# EAGLE design EMG FSR (EAGLE 9.6.2)
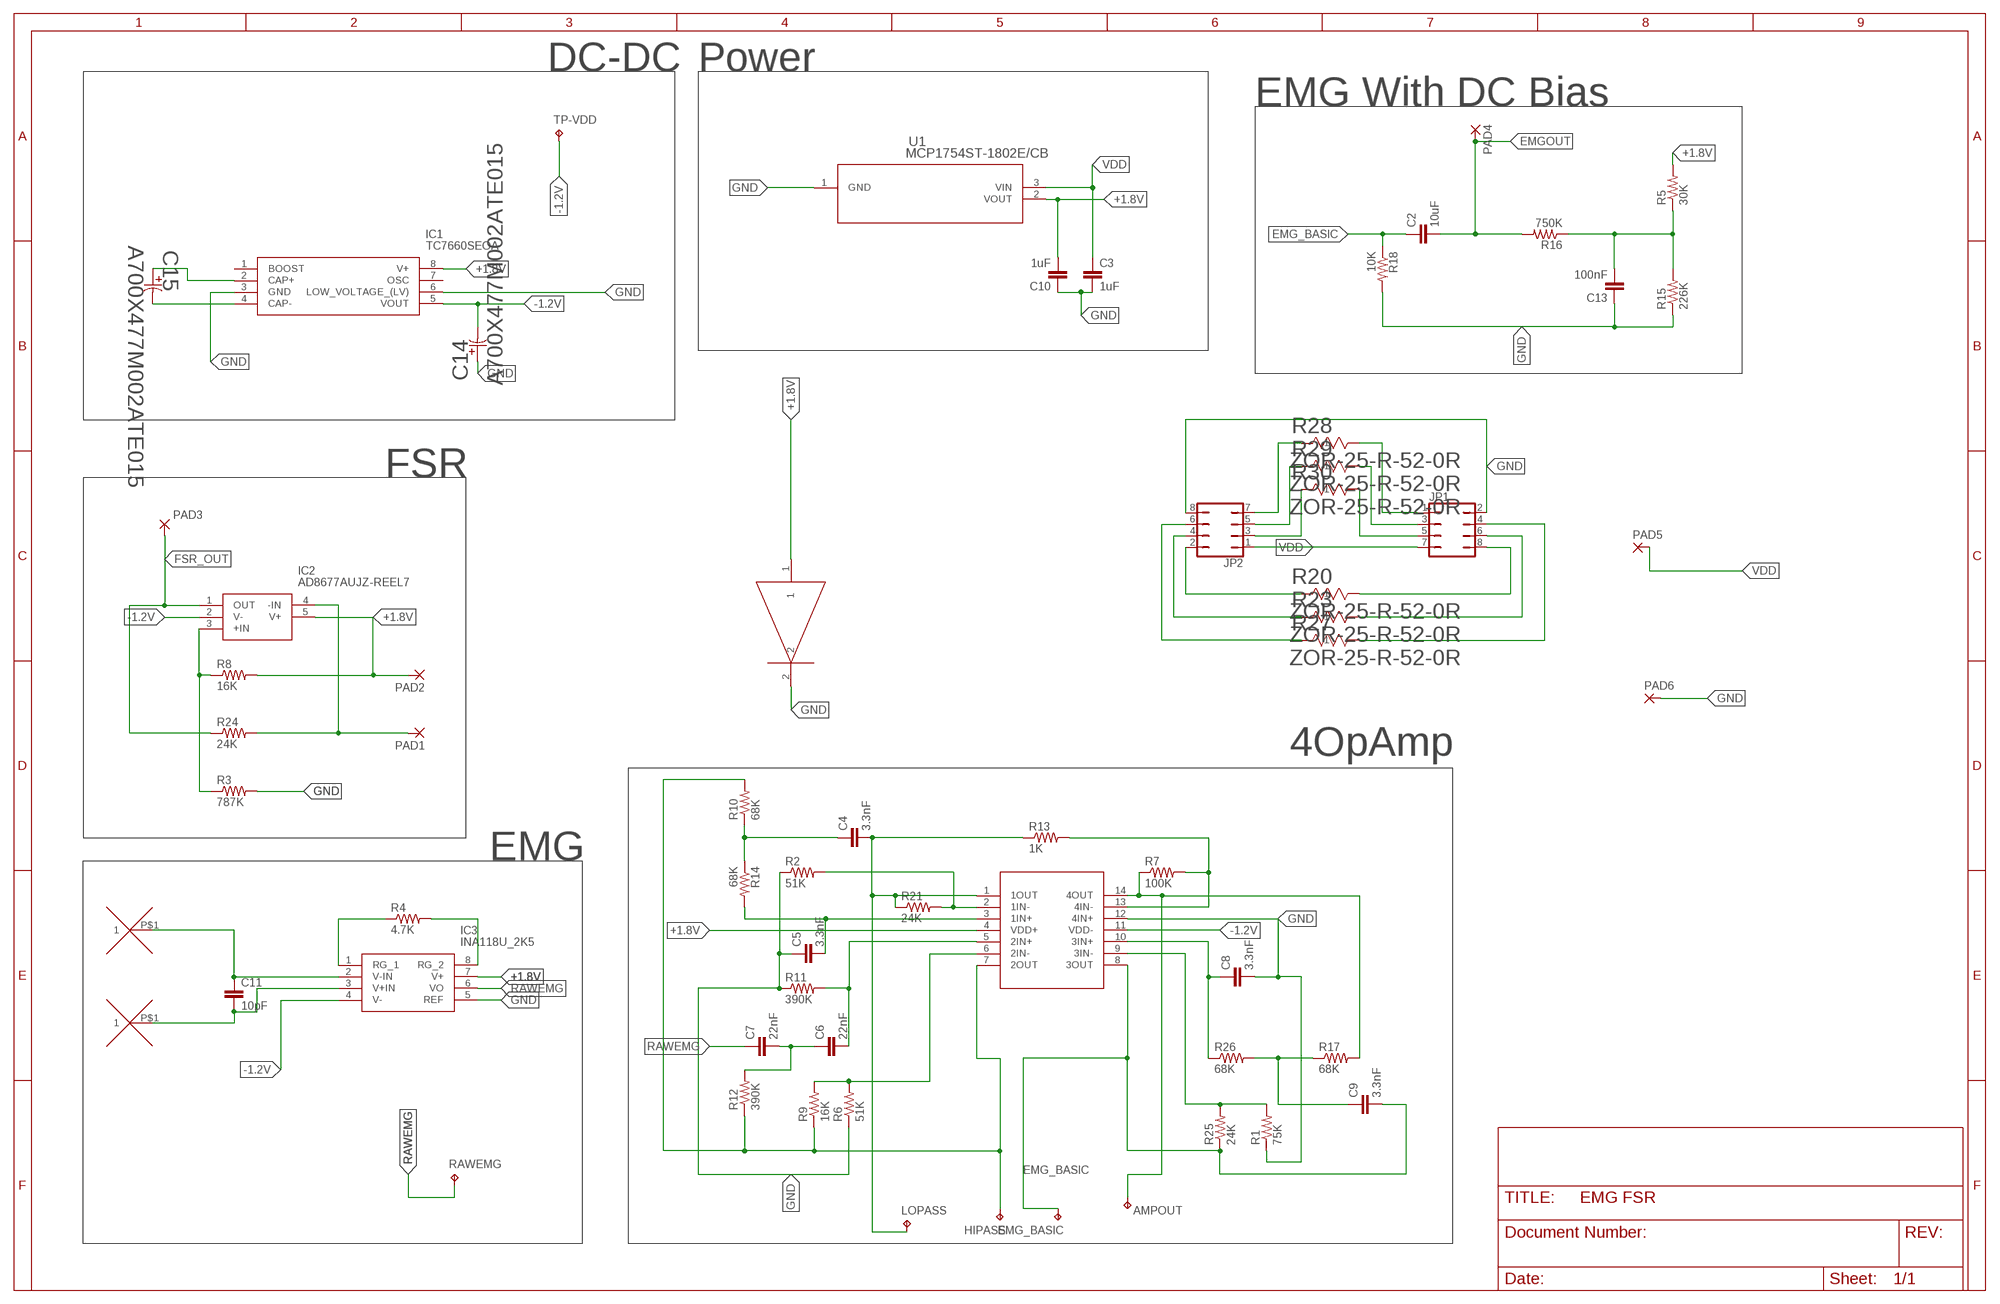
[diagram p0: schematic, sheet 1]

## Parts
AMPOUT  TPTP08R  [TP08R]
C2  10uF  C-EUC0402  [C0402]
C3  1uF  C-EUC0402  [C0402]
C4  3.3nF  C-EUC1206  [C1206]
C5  3.3nF  C-EUC1206  [C1206]
C6  22nF  C-EUC0805  [C0805]
C7  22nF  C-EUC0805  [C0805]
C8  3.3nF  C-EUC1206  [C1206]
C9  3.3nF  C-EUC1206  [C1206]
C10  1uF  C-EUC0402  [C0402]
C11  10pF  C-EUC0402  [C0402]
C13  100nF  C-EUC0402  [C0402]
C14  A700X477M002ATE015  [PCAP7343-43_KEMET_KEM]
C15  A700X477M002ATE015  [PCAP7343-43_KEMET_KEM]
EMG_BASIC  TPTP08R  [TP08R]
HIPASS  TPTP08R  [TP08R]
IC1  TC7660SEOA  [SOIC127P600X175-8N]
IC2  AD8677AUJZ-REEL7  [SOT95P280X100-5N]
IC3  INA118U_2K5  [SOIC127P600X175-8N]
JP1  JP4Q  [JP4Q]
JP2  JP4Q  [JP4Q]
LOPASS  TPTP08R  [TP08R]
PAD1  SMD2  [SMD1,27-2,54]
PAD2  SMD2  [SMD1,27-2,54]
PAD3  1,6/0,8  [1,6/0,8]
PAD4  1,6/0,8  [1,6/0,8]
PAD5  1,6/0,8  [1,6/0,8]
PAD6  1,6/0,8  [1,6/0,8]
R1  75K  R-US_R0402  [R0402]
R2  51K  R-US_R0402  [R0402]
R3  787K  R-US_R0805  [R0805]
R4  4.7K  R-US_R0402  [R0402]
R5  30K  R-US_R0402  [R0402]
R6  51K  R-US_R0402  [R0402]
R7  100K  R-US_R1005  [R1005]
R8  16K  R-US_R0402  [R0402]
R9  16K  R-US_R0402  [R0402]
R10  68K  R-US_R0402  [R0402]
R11  390K  R-US_R0603  [R0603]
R12  390K  R-US_R0603  [R0603]
R13  1K  R-US_R0402  [R0402]
R14  68K  R-US_R0402  [R0402]
R15  226K  R-US_R0402  [R0402]
R16  750K  R-US_R0402  [R0402]
R17  68K  R-US_R0402  [R0402]
R18  10K  R-US_R0402  [R0402]
R20  ZOR-25-R-52-0R  [RES_ZOR25_6P3X2P3_YAG]
R21  24K  R-US_R0402  [R0402]
R23  ZOR-25-R-52-0R  [RES_ZOR25_6P3X2P3_YAG]
R24  24K  R-US_R0402  [R0402]
R25  24K  R-US_R0402  [R0402]
R26  68K  R-US_R0402  [R0402]
R27  ZOR-25-R-52-0R  [RES_ZOR25_6P3X2P3_YAG]
R28  ZOR-25-R-52-0R  [RES_ZOR25_6P3X2P3_YAG]
R29  ZOR-25-R-52-0R  [RES_ZOR25_6P3X2P3_YAG]
R30  ZOR-25-R-52-0R  [RES_ZOR25_6P3X2P3_YAG]
RAWEMG  TPTP08R  [TP08R]
RED  RESC0402X40N  [RESC0402X40N]
TP-VDD  TPTP08R  [TP08R]
U1  MCP1754ST-1802E/CB  [SOT-23A_MC_MCH]
U$1  TLC2274-HT  [SOP65P640X120-14N]
U$2  EMG_VIA  [EMG_VIA]
U$3  EMG_VIA  [EMG_VIA]

## Nets
+1.8V: C10.2 IC1.8(V+) IC2.5(V+) IC3.7(V+) PAD2.1(P) R5.2 R8.2 RED.1 U1.2(VOUT) U$1.4(VDD+)
-1.2V: C14.2 IC1.5(VOUT) IC2.2(V-) IC3.4(V-) TP-VDD.TP U$1.11(VDD-)
EMG_BASIC: C2.1 C9.2 EMG_BASIC.TP R18.1 R25.1 U$1.8(3OUT)
EMGOUT: C2.2 PAD4.1(P) R16.2
FSR_OUT: IC2.1(OUT) PAD3.1(P) R24.1
GND: C3.2 C5.1 C8.2 C10.1 C13.1 C14.1 IC1.3(GND) IC1.6(LOW_VOLTAGE_(LV)) IC3.5(REF) JP1.2 JP2.8 PAD6.1(P) R1.1 R2.1 R3.2 R6.1 R11.1 R15.1 R18.2 RED.2 U1.1(GND) U$1.12(4IN+)
N$1: C15.1 IC1.2(CAP+)
N$2: C15.2 IC1.4(CAP-)
N$3: C11.1 IC3.2(V-IN) U$2.P$1
N$5: C11.2 IC3.3(V+IN) U$3.P$1
N$7: IC2.4(-IN) PAD1.1(P) R24.2
N$8: C13.2 R5.1 R15.2 R16.1
N$9: JP2.3 R30.1
N$10: IC2.3(+IN) R3.1 R8.1
N$11: JP1.5 R30.2
N$12: IC3.1(RG_1) R4.1
N$13: IC3.8(RG_2) R4.2
N$14: C4.2 LOPASS.TP R13.1 R21.1 U$1.1(1OUT)
N$15: JP2.5 R29.1
N$16: JP1.3 R29.2
N$17: AMPOUT.TP R7.1 R17.2 U$1.14(4OUT)
N$18: R7.2 R13.2 U$1.13(4IN-)
N$19: R2.2 R21.2 U$1.2(1IN-)
N$20: C5.2 R14.2 U$1.3(1IN+)
N$21: C4.1 R10.1 R14.1
N$22: JP1.1 R28.2
N$23: C6.1 C7.2 R12.2
N$24: C6.2 R11.2 U$1.5(2IN+)
N$25: JP2.7 R28.1
N$26: R6.2 R9.2 U$1.6(2IN-)
N$27: C9.1 R17.1 R26.2
N$28: C8.1 R26.1 U$1.10(3IN+)
N$29: JP2.2 R20.1
N$30: R1.2 R25.2 U$1.9(3IN-)
N$31: JP1.8 R20.2
N$33: JP1.6 R23.2
N$34: JP2.4 R23.1
N$35: JP2.6 R27.1
N$36: JP1.4 R27.2
PIN7: HIPASS.TP R9.1 R10.2 R12.1 U$1.7(2OUT)
RAWEMG: C7.1 IC3.6(VO) RAWEMG.TP
VDD: C3.1 JP1.7 JP2.1 PAD5.1(P) U1.3(VIN)
Unconnected: IC1.1(BOOST) IC1.7(OSC)

## Notes on the sheet
- DC-DC | Power
- EMG With DC Bias
- FSR
- 4OpAmp
- EMG

## Library data of the parts
AMPOUT EMG_BASIC HIPASS LOPASS RAWEMG TP-VDD = testpad:TP: Test pad
C2-C11 C13 = rcl:C-EU: CAPACITOR, European symbol; SPICEPREFIX: C
C14 C15 = 470uFinal:A700X477M002ATE015; BUILT_BY: EMA_UL_Team; MANUFACTURER_PART_NUMBER: A700X477M002ATE015; SOURCELIBRARY: Kemet_2012-01-01_Caps1_2; VENDOR: Kemet
IC1 = TC7660SEOA:TC7660SEOA: DC-TO-DC VOLTAGE CONVERTER Source: Datasheet <http://componentsearchengine.com/Datasheets/1/TC7660SEOA.pdf>; ARROW_PART_NUMBER: TC7660SEOA; ARROW_PRICE-STOCK: https://www.arrow.com/en/products/tc7660seoa/microchip-technology; DESCRIPTION: DC-TO-DC VOLTAGE CONVERTER; HEIGHT: 1.75mm; MANUFACTURER_NAME: Microchip; MANUFACTURER_PART_NUMBER: TC7660SEOA; MOUSER_PART_NUMBER: 579-TC7660SEOA; MOUSER_PRICE-STOCK: https://www.mouser.co.uk/ProductDetail/Microchip-Technology/TC7660SEOA?qs=cQYLKLPzRJl3hJI5k2EAHg%3D%3D
IC2 = AD8677AUJZ-REEL7:AD8677AUJZ-REEL7: Precision Amplifiers 130uV Max Offset VTG Source: Datasheet <http://www.analog.com/media/en/technical-documentation/data-sheets/AD8677.pdf>; ARROW_PART_NUMBER: AD8677AUJZ-REEL7; ARROW_PRICE-STOCK: https://www.arrow.com/en/products/ad8677aujz-reel7/analog-devices; DESCRIPTION: Precision Amplifiers 130uV Max Offset VTG; HEIGHT: 1mm; MANUFACTURER_NAME: Analog Devices; MANUFACTURER_PART_NUMBER: AD8677AUJZ-REEL7; MOUSER_PART_NUMBER: 584-AD8677AUJZ-R7; MOUSER_PRICE-STOCK: https://www.mouser.co.uk/ProductDetail/Analog-Devices/AD8677AUJZ-REEL7?qs=%2FtpEQrCGXCxIKHu%2FfOAijA%3D%3D
IC3 = INA118U_2K5:INA118U_2K5: Precision, Low Power Instrumentation Amplifier Source: Datasheet <http://www.ti.com/lit/gpn/INA118>; ARROW_PART_NUMBER: INA118U/2K5; ARROW_PRICE-STOCK: https://www.arrow.com/en/products/ina118u2k5/texas-instruments; DESCRIPTION: Precision, Low Power Instrumentation Amplifier; HEIGHT: 1.75mm; MANUFACTURER_NAME: Texas Instruments; MANUFACTURER_PART_NUMBER: INA118U/2K5; MOUSER_PART_NUMBER: 595-INA118U/2K5; MOUSER_PRICE-STOCK: https://www.mouser.co.uk/ProductDetail/Texas-Instruments/INA118U-2K5?qs=VBduBm9rCJRVtE6eJbSA%2Fg%3D%3D
JP1 JP2 = jumperFinal:JP4Q: JUMPER
PAD1 PAD2 = wirepad:SMD2: SMD PAD
PAD3-PAD6 = wirepad:1,6/0,8: THROUGH-HOLE PAD
R1 R2 R5 R6 R8-R11 R13-R18 R21 R24-R26 = adafruit:R-US_: RESISTOR, American symbol
R3 = rcl:R-US_: RESISTOR, American symbol; SPICEPREFIX: R
R4 R7 R12 = adafruit@1:R-US_: RESISTOR, American symbol
R20 R23 R27-R30 = zeroOhmsR:ZOR-25-R-52-0R; BUILT_BY: EMA_Anthony; COPYRIGHT: Copyright (C) 2018 Accelerated Designs. All rights reserved; MANUFACTURER_PART_NUMBER: ZOR-25-R-52-0R; SOURCELIBRARY: Yageo_2018-10-19; VENDOR: Yageo
RED = RESC0402X40N:RESC0402X40N; A_MAX: 0.4; A_MIN: 0.4; A_NOM: 0.4; D_MAX: 1.1; D_MIN: 0.95; D_NOM: 1.0; E_MAX: 0.55; E_MIN: 0.45; E_NOM: 0.5; L1_MAX: 0.3; L1_MIN: 0.15; L1_NOM: 0.25; L_MAX: 0.3; L_MIN: 0.15; L_NOM: 0.25; MANUFACTURER: KOA; STANDARD: IPC 7351B
U1 = MCP1754ST:MCP1754ST-1802E/CB; BUILT_BY: EMA_Jessica; COPYRIGHT: Copyright (C) 2018 Accelerated Designs. All rights reserved; MANUFACTURER_PART_NUMBER: MCP1754ST-1802E/CB; SOURCELIBRARY: Microchip_2019-08-23_13; VENDOR: Microchip
U$1 = TLC2274-HT:TLC2274-HT
U$2 U$3 = EMG_VIA:EMG_VIA

## Board
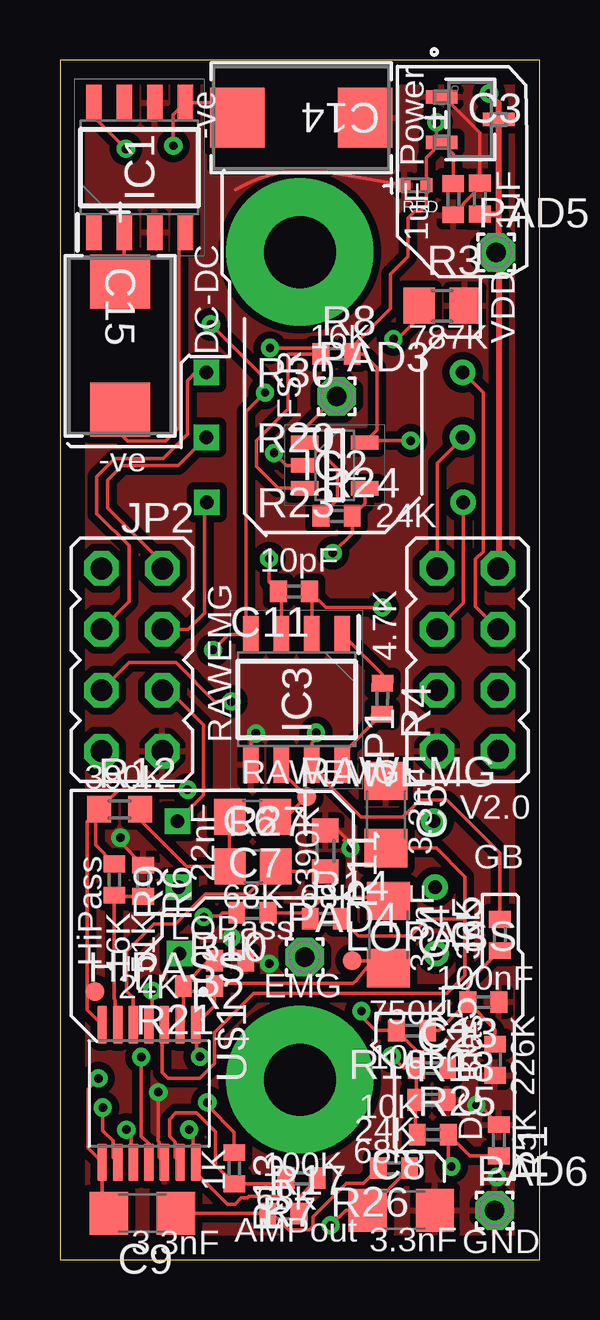
[diagram p1: board, top side]
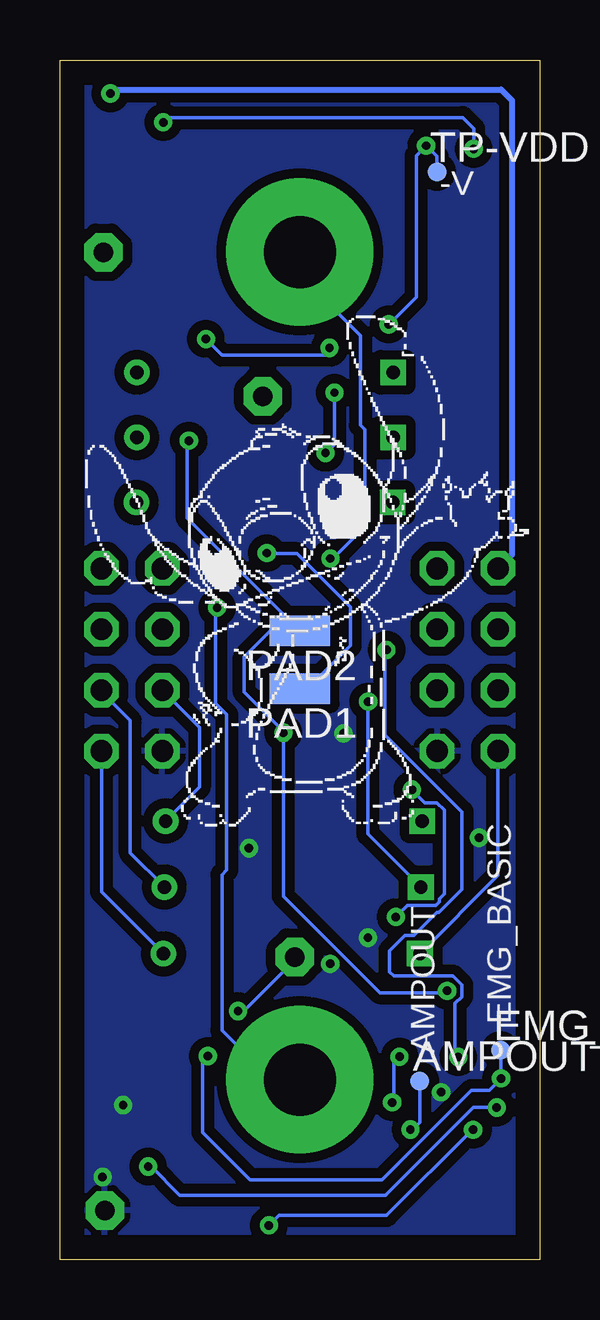
[diagram p2: board, bottom side, seen from below]

Size 20 x 50 mm. Coordinates in mm from the lower left corner, seen from the top.
Outline: 0,0 20,0 20,50 0,50 0,0
Copper layers (1*16): Top 0.035mm / dielectric 1.5mm / Bottom 0.035mm
Design rules "default": minimum track width 6mil, minimum drill 0.35mm, track to track 6mil, track to pad 6mil, pad to pad 6mil, via to via 6mil, smd to smd 6mil, copper to edge 40mil, drill to drill 6mil, minimum pad ring 10mil, minimum via ring 8mil, stop-mask expansion 4mil, vias tented up to drill 0mil, thermal gap 10mil

### Footprints (pad centres in the part's own frame; a part is rotated, then mirrored left to right if it is on the bottom)
TP08R = smd 0.8 x 0.8: TP 0,0
C0402 = smd 0.7 x 0.9: 1 -0.65,0; 2 0.65,0
C1206 = smd 1.6 x 1.8: 1 -1.4,0; 2 1.4,0
C0805 = smd 1.3 x 1.5: 1 -0.95,0; 2 0.95,0
PCAP7343-43_KEMET_KEM = smd 2.261 x 2.489: 1 -2.667,0; 2 2.667,0
SOIC127P600X175-8N = smd 1.5 x 0.65: 1 -2.7,1.905; 2 -2.7,0.635; 3 -2.7,-0.635; 4 -2.7,-1.905; 5 2.7,-1.905; 6 2.7,-0.635; 7 2.7,0.635; 8 2.7,1.905
SOT95P280X100-5N = smd 1.15 x 0.6: 1 -1.25,0.95; 2 -1.25,0; 3 -1.25,-0.95; 4 1.25,-0.95; 5 1.25,0.95
SOIC127P600X175-8N' = smd 1.528 x 0.65: 1 -2.711,1.905; 2 -2.711,0.635; 3 -2.711,-0.635; 4 -2.711,-1.905; 5 2.711,-1.905; 6 2.711,-0.635; 7 2.711,0.635; 8 2.711,1.905
JP4Q = drill 0.914 octagon: 1 -3.81,-1.27; 2 -3.81,1.27; 3 -1.27,-1.27; 4 -1.27,1.27; 5 1.27,-1.27; 6 1.27,1.27; 7 3.81,-1.27; 8 3.81,1.27
SMD1,27-2,54 = smd 1.27 x 2.54: 1 0,0
1,6/0,8 = drill 0.813 pad 1.6 octagon: 1 0,0
R0402 = smd 0.7 x 0.9: 1 -0.65,0; 2 0.65,0
R0805 = smd 1.3 x 1.5: 1 -0.95,0; 2 0.95,0
R1005 = smd 0.7 x 0.9: 1 -0.65,0; 2 0.65,0
R0603 = smd 1 x 1.1: 1 -0.85,0; 2 0.85,0
RES_ZOR25_6P3X2P3_YAG = drill 0.559 pad 1.067 square: 1 0,0 | drill 0.559 pad 1.067: 2 10.693,0
RESC0402X40N = smd 0.51 x 0.6: 1 -0.465,0; 2 0.465,0
SOT-23A_MC_MCH = smd 0.559 x 1.321: 1 -0.95,-1.195; 2 0.95,-1.195; 3 0,1.195
SOP65P640X120-14N = smd 1.57 x 0.41: 1 -2.87,1.95; 2 -2.87,1.3; 3 -2.87,0.65; 4 -2.87,0; 5 -2.87,-0.65; 6 -2.87,-1.3; 7 -2.87,-1.95; 8 2.87,-1.95; 9 2.87,-1.3; 10 2.87,-0.65; 11 2.87,0; 12 2.87,0.65; 13 2.87,1.3; 14 2.87,1.95
EMG_VIA = drill 3 pad 6.15: P$1 0,0

### Placement (x,y rotation side)
AMPOUT  5,7.45 0 bottom
C2  15.52,7.98 0 top
C3  17.51,44.22 90 top
C4  13.7,13.55 270 top
C5  13.59,18.55 270 top
C6  8.05,16.39 0 top
C7  8.03,18.45 180 top
C8  14.24,2.06 0 top
C9  3.44,1.93 180 top
C10  16.4,44.19 90 top
C11  9.76,27.85 180 top
C13  17.66,10.73 180 top
C14  10.06,47.59 180 top
C15  2.51,38.09 270 top
EMG_BASIC  1.62,8.72 0 bottom
HIPASS  1.46,11.16 0 top
IC1  3.32,45.52 90 top
IC2  11.46,33.1 0 top
IC3  INA118U_2K5  [SOIC127P600X175-8N']  9.87,23.35 270 top
JP1  17,25 90 top
JP2  3,25 270 top
LOPASS  12.18,12.45 0 top
PAD1  10,23.8 90 bottom
PAD2  10,26.2 90 bottom
PAD3  11.54,35.98 0 top
PAD4  10.2,12.61 0 top
PAD5  18.18,41.99 0 top
PAD6  18.13,2.04 0 top
R1  18.3,4.97 270 top
R2  7.1,12.46 180 top
R3  15.93,39.76 0 top
R4  13.44,23.38 269.1 top
R5  18.34,13.53 90 top
R6  3.47,15.78 270 top
R7  10.08,3.39 180 top
R8  11.54,37.75 0 top
R9  2.27,15.84 270 top
R10  8.02,14.45 180 top
R11  11.07,17.03 270 top
R12  2.49,18.77 0 top
R13  7.27,3.81 270 top
R14  11.08,14.2 0 top
R15  18.14,8.33 90 top
R16  14.69,9.54 180 top
R17  9.32,1.92 0 top
R18  15.48,6.66 0 top
R20  6.1,34.27 0 top
R21  5.8,11.4 180 top
R23  6.12,31.56 0 top
R24  11.54,30.99 0 top
R25  15.55,5.21 0 top
R26  13.93,3.81 180 top
R27  4.9,18.28 0 top
R28  4.99,12.74 0 top
R29  4.95,15.53 0 top
R30  6.1,36.98 0 top
RAWEMG  10.29,19.3 0 top
RED  14.82,44.78 180 top
TP-VDD  4.28,45.34 0 bottom
U1  17.11,47.51 270 top
U$1  3.71,6.92 270 top
U$2  10,7.5 0 top
U$3  10,42 0 top

### Tracks (layer width: path | path; a pad name or v marks a point on that pad's centre or on a via)
+1.8V  (via drill 0.35)
  Top 0.152: U1.2 16.4,46.08 C10.2 | U1.2 15.69,46.79 v15.69,47.4 | v2.75,46.3 1.41,47.63 IC1.8 | v14.62,34.13 12.79,34.13 IC2.5 13.22,34.56 13.22,37.17 12.65,37.75 R8.2 12.19,38.05 13.77,39.63 13.77,41.07 14.5,41.8 14.5,43.4 14.8,43.7 15.04,43.7 15.29,43.95 RED.1 15.29,45.94 U1.2 | v10.68,21.96 10.77,21.88 10.77,21.79 10.51,21.52 IC3.7 11.22,19.92 11.22,19.78 12.56,18.44 14.29,18.44 15.01,19.16 16.13,19.16 18.34,16.95 R5.2 | U$1.4 3.85,9.93 v3.85,11.2
  Bottom 0.152: v15.69,47.4 15.5,47.6 3.21,47.6 2.75,47.14 v2.75,46.3 | v14.62,34.13 14.7,34.13 14.7,30.9 PAD2.1 11.24,26.2 12.32,25.11 12.32,23.65 10.73,22.06 10.73,22 v10.68,21.96 10.68,15.14 6.66,11.12 3.94,11.12 v3.85,11.2
-1.2V  (via drill 0.35, 0.35 pad 0.55)
  Top 0.152: C14.2 6.77,48.22 IC1.5 4.73,47.72 v4.73,46.43 | v8.93,33.62 9.44,33.1 IC2.2 | v6.29,38.98 8.43,36.84 8.43,36.25 v8.55,36.13 7.76,35.34 7.76,26.26 IC3.4 7.03,26.06 v6.38,25.41 | v3.39,8.44 3.39,5.14 3.71,4.82 U$1.11
  Bottom 0.152: v8.55,36.13 8.55,33.98 v8.92,33.61 v8.93,33.62 | v3.39,8.44 3.52,8.57 3.52,10.68 3.25,10.95 3.25,11.46 3.61,11.82 6.07,11.82 6.25,12 6.25,12.87 5.62,13.51 5.24,13.51 4.28,14.46 4.2,14.46 3.23,15.42 3.23,18.67 6.44,21.87 6.44,25.35 v6.38,25.41 | v6.29,38.98 6.28,38.98 5.14,40.11 5.14,46.02 v4.73,46.43 4.28,45.98 TP-VDD.TP
EMG_BASIC  (via drill 0.35)
  Top 0.152: C9.2 1.76,2.21 U$1.8 1.17,4.64 1.17,7.12 v1.6,7.55 | R25.1 14.83,5.28 R18.1 14.87,6.69 C2.1 14.33,7.98 v13.84,8.48
  Bottom 0.152: EMG_BASIC.TP 1.62,7.68 1.6,7.66 v1.6,7.55 2.1,7.05 2.85,7.05 6.57,3.33 12.07,3.33 14.04,5.31 14.04,8.27 v13.84,8.48
EMGOUT  (via drill 0.35)
  Top 0.152: C2.2 16.17,8.19 15.7,8.66 14.92,8.66 R16.2 13.16,9.54 12.57,10.13 v12.57,10.36
  Bottom 0.152: v12.57,10.36 12.33,10.36 10.21,12.48 PAD4.1
FSR_OUT
  Top 0.152: R24.1 11.57,31.67 11.57,32.94 10.5,34.01 10.21,34.01 IC2.1 10.21,34.66 PAD3.1
GND  (via drill 0.35 pad 0.55)
  Top 0.152: U1.1 16.01,48.46 17.51,46.97 C3.2 17.51,44.69 16.83,44.01 16.83,43.97 C10.1 | R11.1 11.6,17.88 11.93,17.55 11.85,17.46 12.12,17.19 v12.12,17.14 | IC3.5 7.96,21.72 v8.17,21.93 | R6.1 2.52,17.38 v2.52,17.58 | R1.1 17.48,6.44 v17.36,6.44 | R2.1 7.75,12.49 | v4.1,6.97 4.1,4.94 4.15,4.9 4.15,4.26 U$1.12 | R2.1 7.16,13.06 v7.16,13.41 | R2.1 8.59,12.46 v8.73,12.32 | 11.68,45.23 11.41,45.27 11.31,45.29 | 11.31,45.29 11.13,45.32 arc41 7.32,44.59 | 11.68,45.23 11.31,45.29 | RED.2 11.68,45.23
  Bottom 0.152: v12.12,17.14 12.12,17.24 | v8.17,21.93 v8.16,21.92 8.15,21.92 | v2.52,17.58 2.48,17.54 2.43,17.54
  other vias: 18.22,3.44
  pour Bottom (isolate 0.4): 0,-0.02 20,-0.02 20.02,-0.04 20.02,49.89 19.98,49.92 0,49.92 0,0.05 -0.05,0
  pour Top (isolate 0.305): 0,50 0,0 20,0 20,50
N$1
  Top 0.152: IC1.2 2.68,40.93 C15.1
N$2
  Top 0.152: IC1.4 4.96,42.55 4.96,34.67 4.41,34.12 2.82,34.12 2.51,34.43 C15.2
N$3  (via drill 0.35)
  Top 0.152: v13.45,27.17 11.09,27.17 C11.1 10.51,27.75 IC3.2
  Bottom 0.152: U$2.P$1 11.19,7.5 13.25,9.56 13.25,16.04 13.05,16.24 13.05,22.72 13.51,23.18 13.51,27.11 v13.45,27.17
N$5  (via drill 0.35)
  Top 0.152: v8.72,29.22 8.72,28.24 C11.2 9.23,27.72 IC3.3
  Bottom 0.152: U$3.P$1 10,41.03 7.47,38.5 7.47,34.77 7.29,34.59 7.29,30.54 8.61,29.22 v8.72,29.22
N$7  (via drill 0.35)
  Top 0.152: IC2.4 12.71,31.51 R24.2 12.19,30.26 v11.37,29.45
  Bottom 0.152: PAD1.1 9.67,23.8 7.89,25.59 7.89,27.2 10.11,29.43 11.37,29.43 v11.37,29.45
N$8
  Top 0.152: R16.1 15.82,9.54 C13.2 | C13.2 17.01,11.54 R5.1 | C13.2 18.14,9.6 R15.2
N$9
  Top 0.152: JP2.3 2.88,27.42 2.88,29.75 1.56,31.08 1.53,31.08 1.53,32.64 2.28,33.39 4.31,33.39 5.33,34.41 5.33,36.64 5.67,36.98 R30.1
N$10  (via drill 0.35)
  Top 0.152: IC2.3 9.09,32.15 8.19,33.05 8.19,34.14 9.51,35.45 9.51,37.75 R8.1 10.64,38 v8.76,38 | R3.1 14.98,39.28 14.02,38.31 13.97,38.31 v13.91,38.37
  Bottom 0.152: v13.91,38.37 13.23,37.69 8.76,37.69 v8.76,38
N$11
  Top 0.152: R30.2 17.65,36.13 17.65,29.52 17.33,29.2 17.33,27.21 JP1.5
N$12
  Top 0.152: IC3.1 13.45,24.38 R4.1
N$13
  Top 0.152: R4.2 11.78,21.08 IC3.8
N$14  (via drill 0.35)
  Top 0.152: v6.15,6.55 6.19,6.51 6.19,6.39 7.27,5.31 R13.1 | v5.84,8.46 5.84,8.54 5.69,8.69 5.69,9.76 U$1.1 6.45,10.57 R21.1 6.55,11.51 12.22,11.51 12.33,11.62 12.79,12.15 C4.2 13.4,12.45 LOPASS.TP
  Bottom 0.152: v6.15,6.55 6.08,6.55 6.08,8.22 v5.84,8.46
N$15  (via drill 0.35)
  Top 0.152: v7.15,23.26 6.46,23.26 4.83,24.88 2.88,24.88 JP2.5
  Bottom 0.152: R29.1 7.16,17.74 7.16,23.24 v7.15,23.26
N$16
  Bottom 0.152: JP1.3 18.27,23.67 17.07,22.47 17.07,16.95 R29.2
N$17  (via drill 0.35)
  Top 0.152: v5.38,5.42 5.37,5.41 5.37,5.3 5.54,5.13 5.54,4.17 U$1.14 5.66,3.64 6.99,2.31 7.3,2.31 7.56,2.58 7.81,2.58 7.87,2.64 9.25,2.64 R17.2 9.97,2.54 R7.1
  Bottom 0.152: v5.38,5.42 5.3,5.42 5,5.72 AMPOUT.TP
N$18
  Top 0.152: U$1.13 4.8,4.26 4.8,4.9 4.57,5.12 4.57,5.85 4.83,6.11 5.7,6.11 6.49,5.32 6.49,3.94 7.2,3.23 R13.2 9.2,3.15 R7.2
N$19
  Top 0.152: U$1.2 5.15,9.92 R21.2 6.21,12.46 R2.2
N$20
  Top 0.152: U$1.3 4.26,9.69 4.26,7.8 4.51,7.55 5.83,7.55 6.45,8.17 6.45,9.47 8.08,11.1 16.13,11.1 16.88,11.85 16.88,14.19 | C5.2 15.69,17.15 16.88,15.96 16.88,14.19 | 16.88,14.19 15.31,14.19 14.61,13.48 12.45,13.48 R14.2
N$21
  Top 0.152: R10.1 10.18,14.45 R14.1 10.44,14.55 10.97,15.09 13.56,15.09 C4.1
N$22
  Bottom 0.152: R28.2 18.27,15.33 JP1.1
N$23
  Top 0.152: C7.2 7.08,16.41 C6.1 5.27,16.39 3.34,18.33 R12.2
N$24
  Top 0.152: U$1.5 3.06,10.9 2.78,11.19 2.78,12.85 3.93,14 4.83,14 6.07,15.24 7.85,15.24 C6.2 9.21,16.39 9.33,16.27 9.44,16.27 9.71,16.18 R11.2
N$25
  Bottom 0.152: R28.1 1.73,16 JP2.7
N$26
  Top 0.152: R6.2 2.32,15.13 R9.2 2.27,10.87 2.31,10.83 2.31,9.89 U$1.6
N$27
  Top 0.152: C9.1 R17.1 8.67,1.74 9.03,1.74 9.52,1.24 10.41,1.24 10.54,1.38 10.54,1.79 11.94,3.19 12.66,3.19 R26.2
N$28  (via drill 0.35)
  Top 0.152: U$1.10 2.97,4.14 2.97,5.21 v2.77,5.41 | v11.29,1.42 11.92,2.06 C8.1 R26.1
  Bottom 0.152: v2.77,5.41 2.8,5.41 6.38,1.83 10.87,1.83 v11.29,1.42
N$29
  Top 0.152: R20.1 4.92,33.08 2.6,33.08 2,32.49 2,31.32 4.27,29.05 JP2.2
N$30  (via drill 0.35)
  Top 0.152: R1.2 17.09,4.32 R25.2 16.2,4 v16.32,3.88 | v1.79,6.33 1.79,5.37 2.21,4.95 2.21,4.25 U$1.9
  Bottom 0.152: v1.79,6.33 2.77,6.33 6.42,2.68 15.01,2.68 16.21,3.88 v16.32,3.88
N$31
  Top 0.152: R20.2 15.73,33.2 JP1.8
N$33
  Top 0.152: R23.2 16.82,27.36 JP1.6
N$34
  Top 0.152: R23.1 6.02,31.45 6.02,26.95 5.34,26.27 JP2.4
N$35
  Top 0.152: R27.1 5.99,19.37 5.99,22.27 4.53,23.73 JP2.6
N$36
  Bottom 0.152: JP1.4 14.18,22.18 14.18,19.69 R27.2
PIN7  (via drill 0.35)
  Top 0.152: 1.48,18.61 R12.1 2.45,19.58 v5.32,19.58 | 1.48,18.61 1.14,18.27 1.14,11.23 | 1.14,11.23 1.14,10.41 U$1.7 | R9.1 1.48,17.27 1.48,18.61 | R10.2 6.78,14.45 6.65,14.32 6,14.32 v6,14.28 | HIPASS.TP 1.2,11.16 1.14,11.23
  Bottom 0.152: v5.32,19.58 4.77,19.04 4.27,19.04 3.98,18.75 3.98,15.24 4.19,15.04 4.19,14.9 4.32,14.76 5.51,14.76 v6,14.28
RAWEMG
  Top 0.152: IC3.6 9.23,20.35 RAWEMG.TP 9.44,18.45 C7.1
VDD  (via drill 0.35)
  Top 0.152: JP1.7 18.3,28.84 | 17.9,48.59 v17.9,48.61 | C3.1 | 18.29,43.57 | U1.3 18.29,47.53 | 18.3,41.87 PAD5.1 18.19,41.99 18.29,42.09
  Top 0.254: 18.3,41.87 18.3,28.84 | 18.29,42.09 18.29,43.57 | 17.9,48.59 18.29,48.2 18.29,47.53 18.29,43.57 C3.1
  Bottom 0.152: v17.9,48.61 17.74,48.76
  Bottom 0.254: 17.74,48.76 1.6,48.76 1.16,48.31 1.16,29.39 JP2.1

### Text on the board
tPlace: -ve | Power | 1uF | 1uF | DC-DC | 16K | 787K | VDD | FSR | -ve | 24K | 10pF | 4.7K | RAWEMG | 390K | RAWEMG | 390K | V2.0 | 3.3nF | 22nF | GB | 68K | 68K | LOPass | HiPass | 16K | 51K | 51K | 3.3nF | 30K | 24K | EMG | 100nF | 750K | 10uF | 226K | 10K | 24K | DC Bias | 68K | 75K | 1K | 100K | 68K | AMPout | 3.3nF | 3.3nF | GND
bPlace: -V | EMG_BASIC | AMPOUT